# Altium schematic sheet Mixers.SchDoc
size A4; SheetNumber: 12; SheetTotal: 13
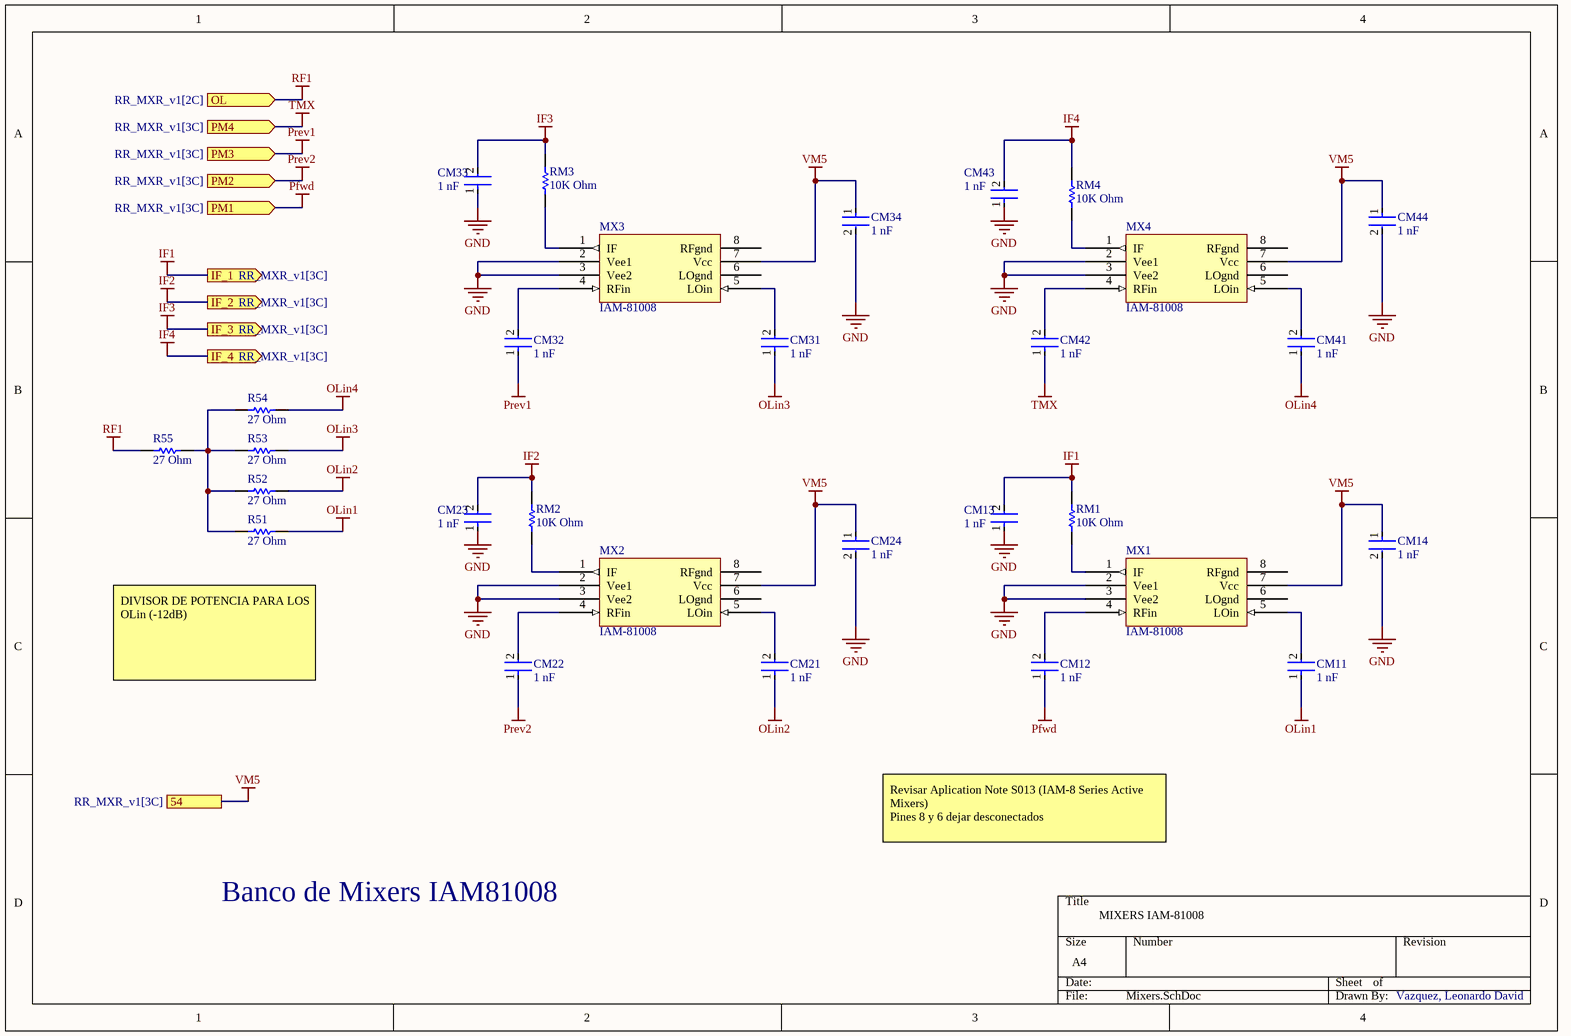
[diagram p0: Mixers.SchDoc]

## Parts
CM11  1 nF  [FP-CC0805-0_85-MFG]
CM12  1 nF  [FP-CC0805-0_85-MFG]
CM13  1 nF  [FP-CC0805-0_85-MFG]
CM14  1 nF  [FP-CC0805-0_85-MFG]
CM21  1 nF  [FP-CC0805-0_85-MFG]
CM22  1 nF  [FP-CC0805-0_85-MFG]
CM23  1 nF  [FP-CC0805-0_85-MFG]
CM24  1 nF  [FP-CC0805-0_85-MFG]
CM31  1 nF  [FP-CC0805-0_85-MFG]
CM32  1 nF  [FP-CC0805-0_85-MFG]
CM33  1 nF  [FP-CC0805-0_85-MFG]
CM34  1 nF  [FP-CC0805-0_85-MFG]
CM41  1 nF  [FP-CC0805-0_85-MFG]
CM42  1 nF  [FP-CC0805-0_85-MFG]
CM43  1 nF  [FP-CC0805-0_85-MFG]
CM44  1 nF  [FP-CC0805-0_85-MFG]
MX1  IAM-81008  [IAM-81008]
MX2  IAM-81008  [IAM-81008]
MX3  IAM-81008  [IAM-81008]
MX4  IAM-81008  [IAM-81008]
R51  27 Ohm  [RESC2013X60X40ML20T25]
R52  27 Ohm  [RESC2013X60X40ML20T25]
R53  27 Ohm  [RESC2013X60X40ML20T25]
R54  27 Ohm  [RESC2013X60X40ML20T25]
R55  27 Ohm  [RESC2013X60X40ML20T25]
RM1  10K Ohm  [RESC2013X60X40ML20T25]
RM2  10K Ohm  [RESC2013X60X40ML20T25]
RM3  10K Ohm  [RESC2013X60X40ML20T25]
RM4  10K Ohm  [RESC2013X60X40ML20T25]

## Ports
54 (see RR_MXR_v1[3C]), IF_1 (out, see RR_MXR_v1[3C]), IF_2 (out, see RR_MXR_v1[3C]), IF_3 (out, see RR_MXR_v1[3C]), IF_4 (out, see RR_MXR_v1[3C]), OL (in, see RR_MXR_v1[2C]), PM1 (in, see RR_MXR_v1[3C]), PM2 (in, see RR_MXR_v1[3C]), PM3 (in, see RR_MXR_v1[3C]), PM4 (in, see RR_MXR_v1[3C])

## Nets
GND: CM13.1 CM14.2 CM23.1 CM24.2 CM33.1 CM34.2 CM43.1 CM44.2 MX1.2(Vee1) MX1.3(Vee2) MX2.2(Vee1) MX2.3(Vee2) MX3.2(Vee1) MX3.3(Vee2) MX4.2(Vee1) MX4.3(Vee2)
IF1: CM13.2 RM1.1 ; port IF_1
IF2: CM23.2 RM2.1 ; port IF_2
IF3: CM33.2 RM3.1 ; port IF_3
IF4: CM43.2 RM4.1 ; port IF_4
OLin1: CM11.1 R51.1
OLin2: CM21.1 R52.1
OLin3: CM31.1 R53.1
OLin4: CM41.1 R54.1
Pfwd: CM12.1 ; port PM1
Prev1: CM32.1 ; port PM3
Prev2: CM22.1 ; port PM2
RF1: R55.2 ; port OL
TMX: CM42.1 ; port PM4
VM5: CM14.1 CM24.1 CM34.1 CM44.1 MX1.7(Vcc) MX2.7(Vcc) MX3.7(Vcc) MX4.7(Vcc) ; port 54
NetCM11_2: CM11.2 MX1.5(LOin)
NetCM12_2: CM12.2 MX1.4(RFin)
NetCM21_2: CM21.2 MX2.5(LOin)
NetCM22_2: CM22.2 MX2.4(RFin)
NetCM31_2: CM31.2 MX3.5(LOin)
NetCM32_2: CM32.2 MX3.4(RFin)
NetCM41_2: CM41.2 MX4.5(LOin)
NetCM42_2: CM42.2 MX4.4(RFin)
NetMX1_1: MX1.1(IF) RM1.2
NetMX2_1: MX2.1(IF) RM2.2
NetMX3_1: MX3.1(IF) RM3.2
NetMX4_1: MX4.1(IF) RM4.2
NetR51_2: R51.2 R52.2 R53.2 R54.2 R55.1

Not connected (* = marked no-connect by the designer): MX1 6(LOgnd) 8(RFgnd); MX2 6(LOgnd) 8(RFgnd); MX3 6(LOgnd) 8(RFgnd); MX4 6(LOgnd) 8(RFgnd)

## Notes on the sheet
- DIVISOR DE POTENCIA PARA LOS OLin (-12dB)
- Revisar Aplication Note S013 (IAM-8 Series Active Mixers)
  Pines 8 y 6 dejar desconectados
- Banco de Mixers IAM81008
- MIXERS IAM-81008
- Vazquez, Leonardo David

## Library data of the parts
CM11-CM14 CM21-CM24 CM31-CM34 CM41-CM44 = CMP-2100-03606-3: CAP CER 0.1UF 50V X7R 0805; Manufacturer Part Number: CC0805KRX7R9BB104; Manufacturer: Yageo; Tolerance: 0.1; Capacitance: 100 nF; Value: 100 nF; Device Class L1: Passive Components; ComponentLink2Description: Datasheet; Package: CC0805-0.85; Digikey Description: CAP CER 0.1UF 50V X7R 0805; Device Class L3: Ceramic Capacitors; Temperature: -30°C to +85°C; Temperature Characteristic: X7R; Voltage Rating: 50 V; Height: 0.95mm; RoHS: TRUE; Ipc Land Pattern Name: CAPC200125X85; Device Class L2: Capacitors; Category: Cap; Temperature Range Low: -30°C; Temperature Range High: +85°C; Material: Ceramic; Mouser Description: Multilayer Ceramic Capacitors MLCC - SMD/SMT 100nF 50V X7R 10%; Footprint Url: http://www.yageo.com/exep/pages/download/literatures/UPY-C_GEN_24.pdf; Automotive: No; Octopart: https://octopart.com/cc0805krx7r9bb104-yageo-192993; Lead Free: Yes; ComponentLink2URL: http://www.yageo.com/documents/recent/UPY-GPHC_Y5V_6.3V-to-50V_8.pdf
MX1-MX4 = IAM-81008: mixer
R51-R55 RM1-RM4 = CMP-2001-00580-1: Manufacturer: Panasonic; Part Number: ERA6AEB101V